# Altium schematic sheet stm32-power.SchDoc
size A4; SheetNumber: 8; SheetTotal: 8
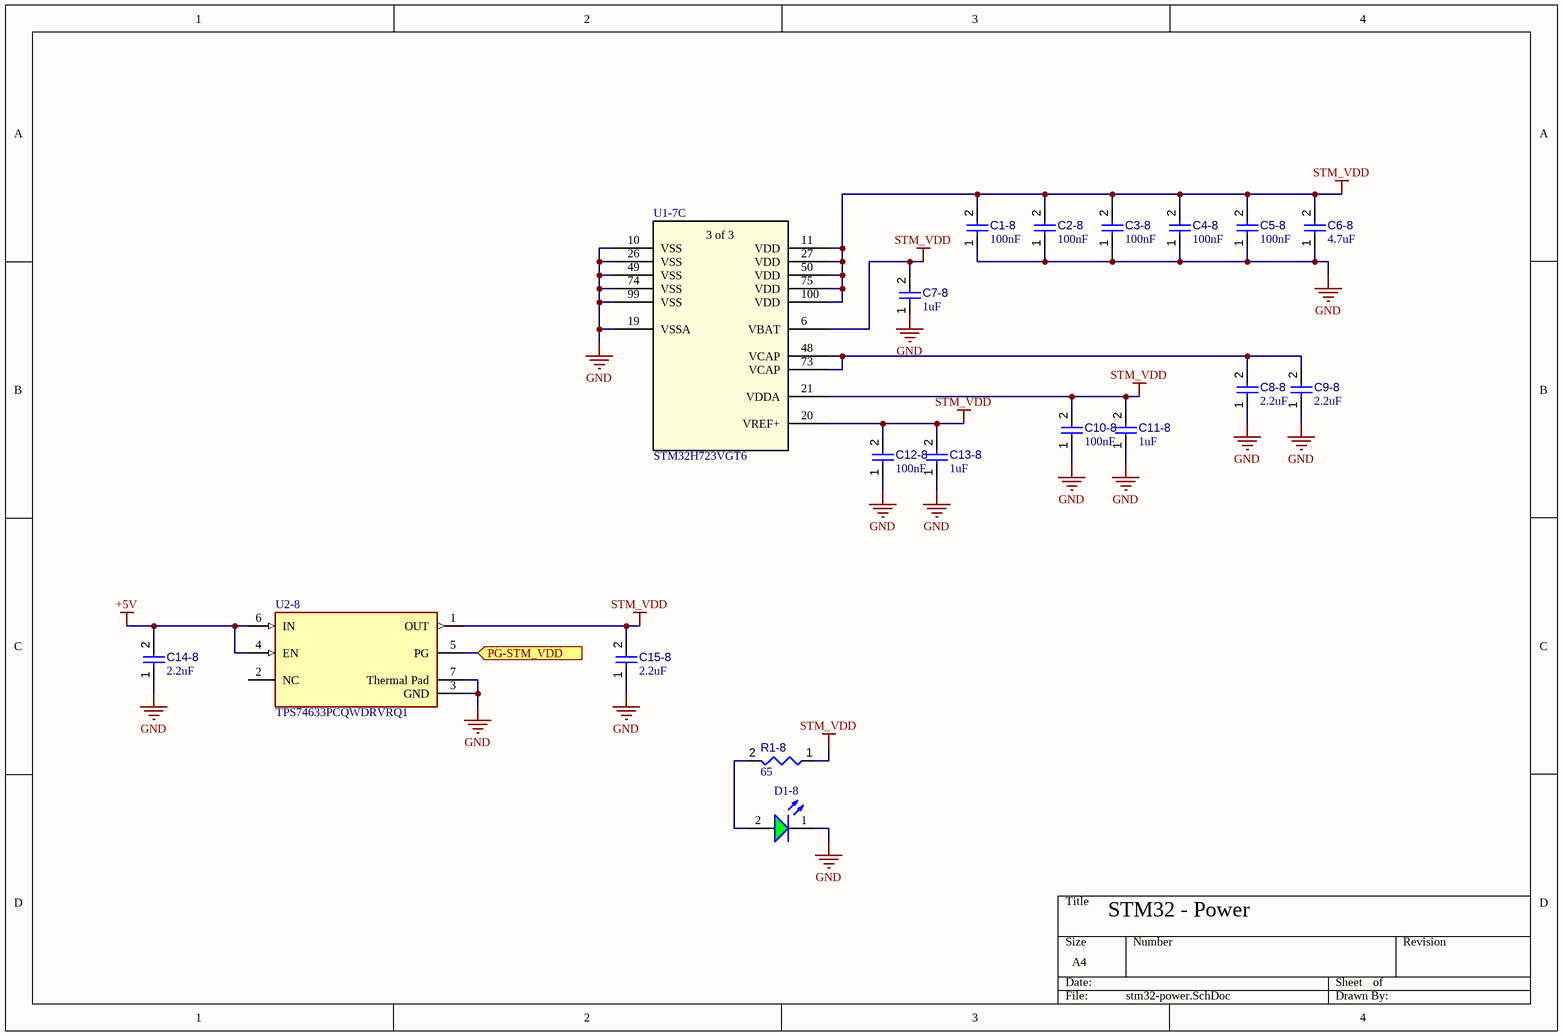
[diagram p0: stm32-power.SchDoc]

## Parts
C1-8  value 100nF  [CAPC1608X94X35NL15T15]  (hidden comment: 100nF 0603)
C2-8  value 100nF  [CAPC1608X94X35NL15T15]  (hidden comment: 100nF 0603)
C3-8  value 100nF  [CAPC1608X94X35NL15T15]  (hidden comment: 100nF 0603)
C4-8  value 100nF  [CAPC1608X94X35NL15T15]  (hidden comment: 100nF 0603)
C5-8  value 100nF  [CAPC1608X94X35NL15T15]  (hidden comment: 100nF 0603)
C6-8  4.7uF  [CAPC1608X94X35NL15T15]
C7-8  value 1uF  [CAPC1608X94X35NL15T15]  (hidden comment: 1uF 0603)
C8-8  value 2.2uF  [CAPC1608X94X35NL15T15]  (hidden comment: 2.2uF 0603)
C9-8  value 2.2uF  [CAPC1608X94X35NL15T15]  (hidden comment: 2.2uF 0603)
C10-8  value 100nF  [CAPC1608X94X35NL15T15]  (hidden comment: 100nF 0603)
C11-8  value 1uF  [CAPC1608X94X35NL15T15]  (hidden comment: 1uF 0603)
C12-8  value 100nF  [CAPC1608X94X35NL15T15]  (hidden comment: 100nF 0603)
C13-8  value 1uF  [CAPC1608X94X35NL15T15]  (hidden comment: 1uF 0603)
C14-8  value 2.2uF  [CAPC1608X94X35NL15T15]  (hidden comment: 2.2uF 0603)
C15-8  value 2.2uF  [CAPC1608X94X35NL15T15]  (hidden comment: 2.2uF 0603)
D1-8  150060VS75000  [WL-SMCW_0603_150060xx75000]  (value not drawn)
R1-8  65  [RESC1608X55X25ML10T15]
U1-7  STM32H723VGT6  [LQFP100_STM]  (part C of 3)
U2-8  TPS74633PCQWDRVRQ1  [FP-DRV0006C-IPC_C]

## Ports
PG-STM_VDD (in, see Sheet1[3C], ESP32[1B])

## Nets
+5V: C14-8.2 U2-8.4(EN) U2-8.6(IN)
GND: C1-8.1 C2-8.1 C3-8.1 C4-8.1 C5-8.1 C6-8.1 C7-8.1 C8-8.1 C9-8.1 C10-8.1 C11-8.1 C12-8.1 C13-8.1 C14-8.1 C15-8.1 D1-8.1(K) U1-7.10(VSS) U1-7.19(VSSA) U1-7.26(VSS) U1-7.49(VSS) U1-7.74(VSS) U1-7.99(VSS) U2-8.3(GND) U2-8.7(Thermal_Pad)
STM_VDD: C1-8.2 C2-8.2 C3-8.2 C4-8.2 C5-8.2 C6-8.2 C7-8.2 C10-8.2 C11-8.2 C12-8.2 C13-8.2 C15-8.2 R1-8.1 U1-7.6(VBAT) U1-7.11(VDD) U1-7.20(VREF+) U1-7.21(VDDA) U1-7.27(VDD) U1-7.50(VDD) U1-7.75(VDD) U1-7.100(VDD) U2-8.1(OUT)
PG-STM_VDD: U2-8.5(PG) ; port PG-STM_VDD
NetC8-8_2: C8-8.2 C9-8.2 U1-7.48(VCAP) U1-7.73(VCAP)
NetD1-8_2: D1-8.2(A) R1-8.2

Not connected (* = marked no-connect by the designer): U2-8 2(NC)

## Notes on the sheet
- STM32 - Power
- (in symbol STM32H723VGT6, part C) 3 of 3

## Library data of the parts
C1-8 C2-8 C3-8 C4-8 C5-8 C6-8 C7-8 C8-8 C9-8 C10-8 C11-8 C12-8 C13-8 C14-8 = CMP-001-00003-6: Tolerance: 10%; Voltage Rating: 16V; Capacitor Type: Ceramic; Max Operating Temperature: 125°C; Pins: 2; Min Operating Temperature: -55°C; RoHS Compliant: True; Mounting Technology: SM; Case/Package: 0603
  C6-8: Value: 4.7uF
C15-8 = CMP-001-00003-6: Chip Capacitor, 1 uF, +/- 10%, 16 V, 0603 (1608 Metric); Voltage Rating: 16V; Capacitor Type: Ceramic; Max Operating Temperature: 125°C; Pins: 2; Tolerance: 10%; Min Operating Temperature: -55°C; RoHS Compliant: True; Mounting Technology: SM; Case/Package: 0603
D1-8 = CMP-1426-00006-6: NexarPartId: 29717778; Reverse Voltage: 5V; Forward Voltage: 2V; Viewing Angle: 140°; Luminous Intensity: 40mcd; Test Current: 20mA; Max Junction Temperature (Tj): 95°C; Wavelength: 570nm; Forward Current: 100mA; Color: Green; Lens Style: Clear, Rectangular; Power Dissipation: 72mW; Peak Wavelength: 572nm; Packaging: Tape and Reel; REACH SVHC: Unknown; Width: 800µm; Max Operating Temperature: 85°C; Number of Pins: 2; RoHS: Compliant; Dominant Wavelength: 570nm; Min Operating Temperature: -40°C; Case Code (Imperial): 0603; Height: 700µm; Length: 1.6mm; Case Code (Metric): 1608; Case/Package: 0603; Max Reverse Voltage (DC): 5V; Mount: Surface Mount
R1-8 = CMP-009-00031-5: Chip Resistor, 4.7 KOhm, +/- 1%, 0.1 W, -55 to 155 degC, 0603 (1608 Metric); Power: 100mW; Tolerance: 1%; Mounting Technology: SM; Case/Package: 0603; Value: 65; RoHS Compliant: True; Pins: 2; Min Operating Temperature: -55°C; Max Operating Temperature: 155°C
U1-7 = STM32H723VGT6: No Description Available; Mfr_Name: STMicroelectronics; RefDes: RefDes; Type: Type
U2-8 = CMP-04917-000362-1: IC REG LINEAR 3.3V 1A 6WSON; RoHS Compliant: Yes